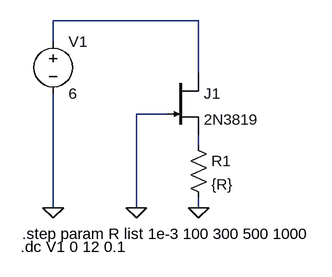
[diagram p0: schematic autopolarizacion_2N3819.asc]
autopolarizacion_2N3819.asc, the LTspice schematic file:
Version 4
SHEET 1 880 680
WIRE 272 48 48 48
WIRE 48 80 48 48
WIRE 272 128 272 48
WIRE 224 192 176 192
WIRE 272 240 272 224
WIRE 48 336 48 160
WIRE 176 336 176 192
WIRE 272 336 272 320
FLAG 272 336 0
FLAG 176 336 0
FLAG 48 336 0
SYMBOL njf 224 128 R0
SYMATTR InstName J1
SYMATTR Value 2N3819
SYMBOL res 256 224 R0
SYMATTR InstName R1
SYMATTR Value {R}
SYMBOL voltage 48 64 R0
WINDOW 123 0 0 Left 0
WINDOW 39 0 0 Left 0
SYMATTR InstName V1
SYMATTR Value 6
TEXT 0 376 Left 2 !.step param R list 1e-3 100 300 500 1000
TEXT -2 396 Left 2 !.dc V1 0 12 0.1

The netlist it stands for:
* autopolarizacion_2N3819.asc
J1 N001 0 N002 2N3819
R1 N002 0 {R}
V1 N001 0 6
.model NJF NJF
.model PJF PJF
.lib standard.jft
.step param R list 1e-3 100 300 500 1000
.dc V1 0 12 0.1
.backanno
.end